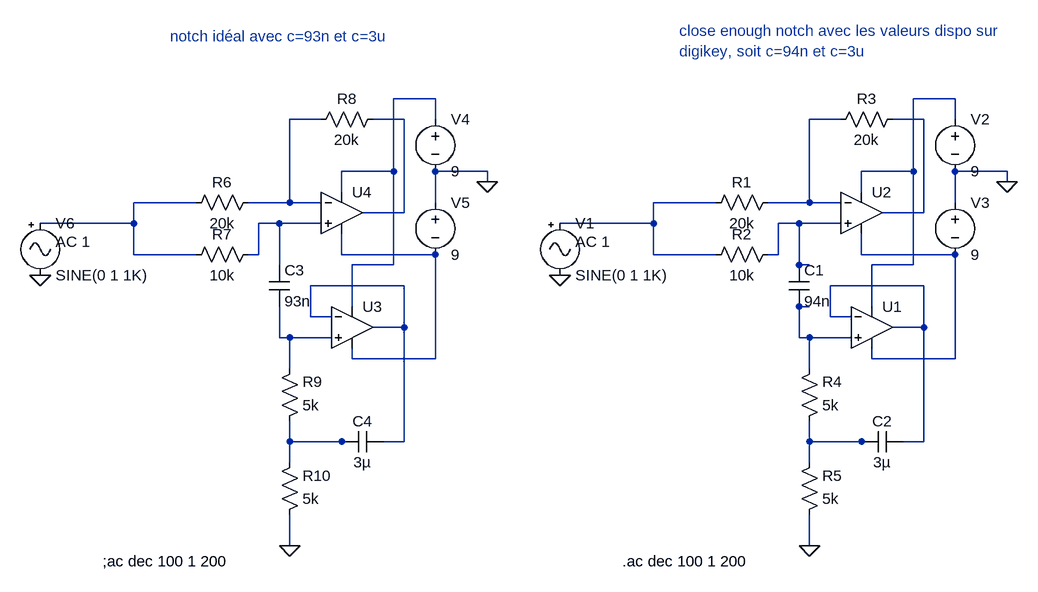
[diagram p0: schematic Simulation notch.asc]
Simulation notch.asc, the LTspice schematic file:
Version 4
SHEET 1 880 680
WIRE -400 -384 -464 -384
WIRE 400 -384 336 -384
WIRE -576 -352 -624 -352
WIRE -448 -352 -496 -352
WIRE -400 -352 -400 -384
WIRE 224 -352 176 -352
WIRE 352 -352 304 -352
WIRE 400 -352 400 -384
WIRE -464 -272 -464 -384
WIRE -464 -272 -544 -272
WIRE -320 -272 -400 -272
WIRE 336 -272 336 -384
WIRE 336 -272 256 -272
WIRE 480 -272 400 -272
WIRE -320 -256 -320 -272
WIRE 480 -256 480 -272
WIRE -544 -240 -544 -272
WIRE 256 -240 256 -272
WIRE -768 -224 -864 -224
WIRE -624 -224 -624 -352
WIRE -624 -224 -688 -224
WIRE -576 -224 -624 -224
WIRE -400 -224 -400 -272
WIRE 32 -224 -64 -224
WIRE 176 -224 176 -352
WIRE 176 -224 112 -224
WIRE 224 -224 176 -224
WIRE 400 -224 400 -272
WIRE -448 -208 -448 -352
WIRE -448 -208 -512 -208
WIRE 352 -208 352 -352
WIRE 352 -208 288 -208
WIRE -864 -192 -864 -224
WIRE -864 -192 -1008 -192
WIRE -640 -192 -672 -192
WIRE -576 -192 -640 -192
WIRE -64 -192 -64 -224
WIRE -64 -192 -208 -192
WIRE 160 -192 128 -192
WIRE 224 -192 160 -192
WIRE -864 -144 -864 -192
WIRE -768 -144 -864 -144
WIRE -672 -144 -672 -192
WIRE -672 -144 -688 -144
WIRE -544 -144 -544 -176
WIRE -400 -144 -544 -144
WIRE -64 -144 -64 -192
WIRE 32 -144 -64 -144
WIRE 128 -144 128 -192
WIRE 128 -144 112 -144
WIRE 256 -144 256 -176
WIRE 400 -144 256 -144
WIRE -640 -128 -640 -192
WIRE -464 -128 -464 -272
WIRE -464 -128 -528 -128
WIRE 160 -128 160 -192
WIRE 176 -128 160 -128
WIRE 336 -128 336 -272
WIRE 336 -128 272 -128
WIRE -448 -96 -592 -96
WIRE 352 -96 208 -96
WIRE -528 -64 -528 -128
WIRE 176 -64 160 -64
WIRE 272 -64 272 -128
WIRE -592 -48 -592 -96
WIRE -560 -48 -592 -48
WIRE 208 -48 208 -96
WIRE 240 -48 208 -48
WIRE -448 -32 -448 -96
WIRE -448 -32 -496 -32
WIRE 352 -32 352 -96
WIRE 352 -32 304 -32
WIRE -640 -16 -640 -64
WIRE -624 -16 -640 -16
WIRE -560 -16 -624 -16
WIRE 160 -16 160 -64
WIRE 176 -16 160 -16
WIRE 240 -16 176 -16
WIRE -528 16 -528 0
WIRE -400 16 -400 -144
WIRE -400 16 -528 16
WIRE 272 16 272 0
WIRE 400 16 400 -144
WIRE 400 16 272 16
WIRE -624 32 -624 -16
WIRE 176 32 176 -16
WIRE -624 144 -624 112
WIRE -544 144 -624 144
WIRE -528 144 -544 144
WIRE -448 144 -448 -32
WIRE -448 144 -480 144
WIRE 176 144 176 112
WIRE 256 144 176 144
WIRE 272 144 256 144
WIRE 352 144 352 -32
WIRE 352 144 320 144
WIRE -624 176 -624 144
WIRE 176 176 176 144
WIRE -624 304 -624 256
WIRE 176 304 176 256
FLAG 480 -256 0
FLAG 176 304 0
FLAG -208 -112 0
FLAG -320 -256 0
FLAG -624 304 0
FLAG -1008 -112 0
SYMBOL res 128 -240 R90
WINDOW 0 0 56 VBottom 2
WINDOW 3 32 56 VTop 2
SYMATTR InstName R1
SYMATTR Value 20k
SYMBOL res 128 -160 R90
WINDOW 0 0 56 VBottom 2
WINDOW 3 32 56 VTop 2
SYMATTR InstName R2
SYMATTR Value 10k
SYMBOL Opamps\\UniversalOpamp2 272 -32 R0
SYMATTR InstName U1
SYMBOL Opamps\\UniversalOpamp2 256 -208 R0
SYMATTR InstName U2
SYMBOL res 320 -368 R90
WINDOW 0 0 56 VBottom 2
WINDOW 3 32 56 VTop 2
SYMATTR InstName R3
SYMATTR Value 20k
SYMBOL res 160 128 M180
WINDOW 0 36 76 Left 2
WINDOW 3 36 40 Left 2
SYMATTR InstName R4
SYMATTR Value 5k
SYMBOL res 160 272 M180
WINDOW 0 36 76 Left 2
WINDOW 3 36 40 Left 2
SYMATTR InstName R5
SYMATTR Value 5k
SYMBOL cap 144 -128 R0
SYMATTR InstName C1
SYMATTR Value 94n
SYMBOL cap 320 128 R90
WINDOW 0 0 32 VBottom 2
WINDOW 3 32 32 VTop 2
SYMATTR InstName C2
SYMATTR Value 3µ
SYMBOL voltage 400 -368 R0
SYMATTR InstName V2
SYMATTR Value 9
SYMBOL voltage 400 -240 R0
SYMATTR InstName V3
SYMATTR Value 9
SYMBOL Misc\\signal -208 -208 R0
WINDOW 123 24 44 Left 2
WINDOW 39 0 0 Left 2
SYMATTR Value2 AC 1
SYMATTR InstName V1
SYMBOL res -672 -240 R90
WINDOW 0 0 56 VBottom 2
WINDOW 3 32 56 VTop 2
SYMATTR InstName R6
SYMATTR Value 20k
SYMBOL res -672 -160 R90
WINDOW 0 0 56 VBottom 2
WINDOW 3 32 56 VTop 2
SYMATTR InstName R7
SYMATTR Value 10k
SYMBOL Opamps\\UniversalOpamp2 -528 -32 R0
SYMATTR InstName U3
SYMBOL Opamps\\UniversalOpamp2 -544 -208 R0
SYMATTR InstName U4
SYMBOL res -480 -368 R90
WINDOW 0 0 56 VBottom 2
WINDOW 3 32 56 VTop 2
SYMATTR InstName R8
SYMATTR Value 20k
SYMBOL res -640 128 M180
WINDOW 0 36 76 Left 2
WINDOW 3 36 40 Left 2
SYMATTR InstName R9
SYMATTR Value 5k
SYMBOL res -640 272 M180
WINDOW 0 36 76 Left 2
WINDOW 3 36 40 Left 2
SYMATTR InstName R10
SYMATTR Value 5k
SYMBOL cap -480 128 R90
WINDOW 0 0 32 VBottom 2
WINDOW 3 32 32 VTop 2
SYMATTR InstName C4
SYMATTR Value 3µ
SYMBOL voltage -400 -368 R0
SYMATTR InstName V4
SYMATTR Value 9
SYMBOL voltage -400 -240 R0
SYMATTR InstName V5
SYMATTR Value 9
SYMBOL Misc\\signal -1008 -208 R0
WINDOW 123 24 44 Left 2
WINDOW 39 0 0 Left 2
SYMATTR Value2 AC 1
SYMATTR InstName V6
SYMBOL cap -656 -128 R0
SYMATTR InstName C3
SYMATTR Value 93n
TEXT -112 328 Left 2 !.ac dec 100 1 200
TEXT -912 328 Left 2 !;ac dec 100 1 200
TEXT -808 -480 Left 2 ;notch idéal avec c=93n et c=3u
TEXT -24 -488 Left 2 ;close enough notch avec les valeurs dispo sur\ndigikey, soit c=94n et c=3u

The netlist it stands for:
* Simulation notch.asc
R1 N005 N008 20k
R2 N010 N008 10k
XU1 N015 N014 N002 N012 N014 level.2 Avol=1Meg GBW=10Meg Slew=10Meg ilimit=25m rail=0 Vos=0 phimargin=45 en=0 enk=0 in=0 ink=0 Rin=500Meg  ; pins IN+ IN- V+ V- OUT
XU2 N010 N005 N002 N012 N006 level.2 Avol=1Meg GBW=10Meg Slew=10Meg ilimit=25m rail=0 Vos=0 phimargin=45 en=0 enk=0 in=0 ink=0 Rin=500Meg  ; pins IN+ IN- V+ V- OUT
R3 N006 N005 20k
R4 N018 N015 5k
R5 0 N018 5k
C1 N010 N015 94n
C2 N014 N018 3µ
V2 N002 0 9
V3 0 N012 9
V1 N008 0 SINE(0 1 1K) AC 1
R6 N003 N007 20k
R7 N009 N007 10k
XU3 N016 N013 N001 N011 N013 level.2 Avol=1Meg GBW=10Meg Slew=10Meg ilimit=25m rail=0 Vos=0 phimargin=45 en=0 enk=0 in=0 ink=0 Rin=500Meg  ; pins IN+ IN- V+ V- OUT
XU4 N009 N003 N001 N011 N004 level.2 Avol=1Meg GBW=10Meg Slew=10Meg ilimit=25m rail=0 Vos=0 phimargin=45 en=0 enk=0 in=0 ink=0 Rin=500Meg  ; pins IN+ IN- V+ V- OUT
R8 N004 N003 20k
R9 N017 N016 5k
R10 0 N017 5k
C4 N013 N017 3µ
V4 N001 0 9
V5 0 N011 9
V6 N007 0 SINE(0 1 1K) AC 1
C3 N009 N016 93n
.ac dec 100 1 200
;ac dec 100 1 200
* notch idéal avec c=93n et c=3u
* close enough notch avec les valeurs dispo sur
* digikey, soit c=94n et c=3u
.lib UniversalOpamps2.sub
.backanno
.end